# EAGLE schematic Fidgetspinner (EAGLE 9.2.1)
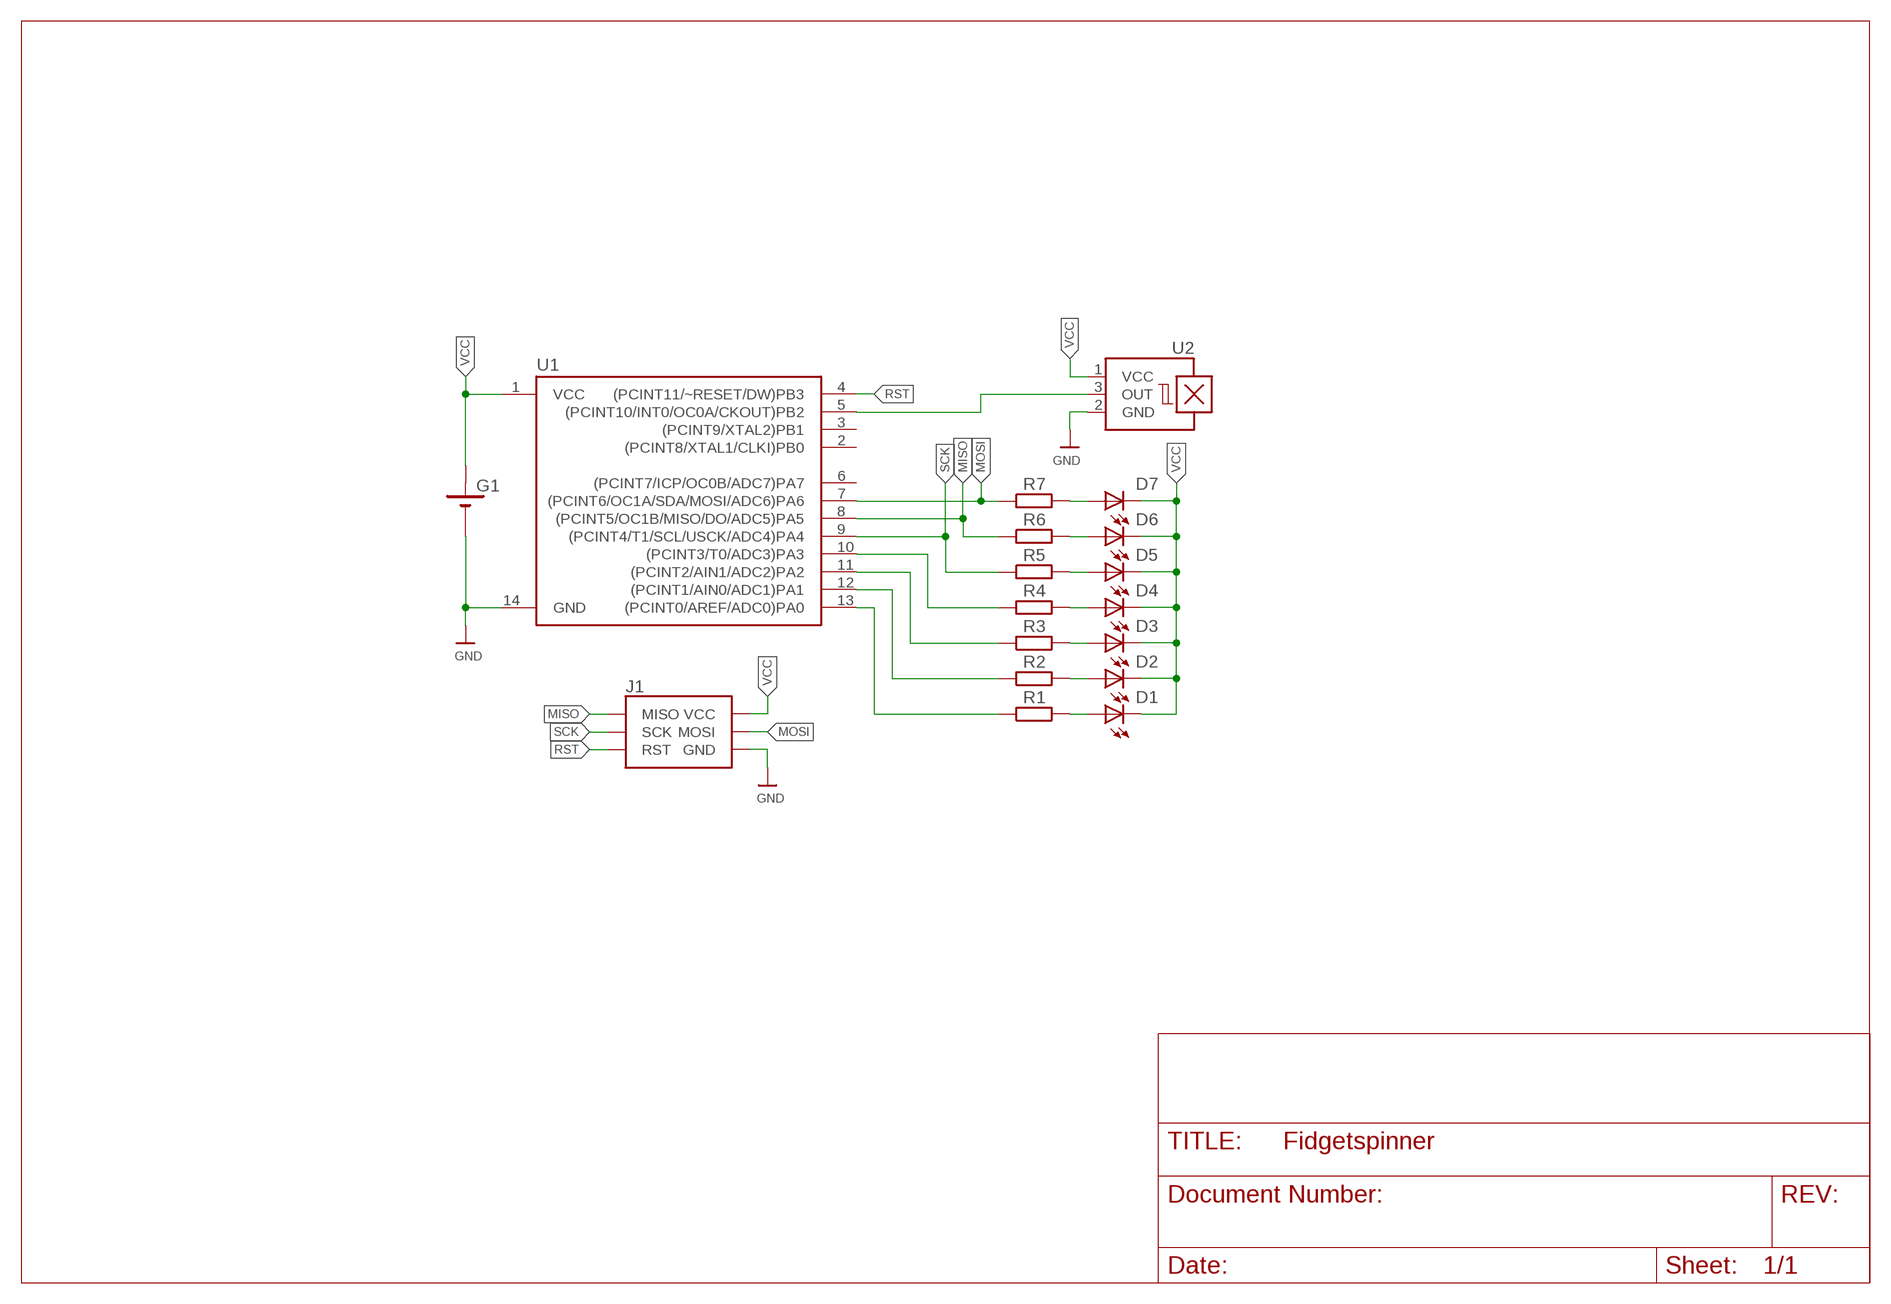
[diagram p0: schematic, sheet 1]

## Parts
D1  LEDCHIPLED_0805  [CHIPLED_0805]
D2  LEDCHIPLED_0805  [CHIPLED_0805]
D3  LEDCHIPLED_0805  [CHIPLED_0805]
D4  LEDCHIPLED_0805  [CHIPLED_0805]
D5  LEDCHIPLED_0805  [CHIPLED_0805]
D6  LEDCHIPLED_0805  [CHIPLED_0805]
D7  LEDCHIPLED_0805  [CHIPLED_0805]
G1  BATTERY  [10MM_SM_COIN_CELL_CLIP]
J1  SPI-HEADER2X3_LOCK  [2X3_LOCK]
R1  RESISTOR0805  [0805]
R2  RESISTOR0805  [0805]
R3  RESISTOR0805  [0805]
R4  RESISTOR0805  [0805]
R5  RESISTOR0805  [0805]
R6  RESISTOR0805  [0805]
R7  RESISTOR0805  [0805]
U1  ATTINY84ATTINY84-20PU  [DIP14]
U2  HALL-SWITCH02UA  [SIP3-UA]

## Nets
GND: G1.- J1.6(GND) U1.14(GND) U2.2(GND)
MISO: J1.1(MISO) R6.1 U1.8((PCINT5/OC1B/MISO/DO/ADC5)PA5)
MOSI: J1.4(MOSI) R7.1 U1.7((PCINT6/OC1A/SDA/MOSI/ADC6)PA6)
N$1: R1.1 U1.13((PCINT0/AREF/ADC0)PA0)
N$2: R2.1 U1.12((PCINT1/AIN0/ADC1)PA1)
N$3: R3.1 U1.11((PCINT2/AIN1/ADC2)PA2)
N$4: R4.1 U1.10((PCINT3/T0/ADC3)PA3)
N$5: U1.5((PCINT10/INT0/OC0A/CKOUT)PB2) U2.3(OUT)
N$8: D1.A R1.2
N$9: D2.A R2.2
N$10: D3.A R3.2
N$11: D4.A R4.2
N$12: D5.A R5.2
N$13: D6.A R6.2
N$14: D7.A R7.2
RST: J1.5(RST) U1.4((PCINT11/~RESET/DW)PB3)
SCK: J1.3(SCK) R5.1 U1.9((PCINT4/T1/SCL/USCK/ADC4)PA4)
VCC: D1.C D2.C D3.C D4.C D5.C D6.C D7.C G1.+@1(+) G1.+@2(+) J1.2(VCC) U1.1(VCC) U2.1(VCC)
Unconnected: U1.2((PCINT8/XTAL1/CLKI)PB0) U1.3((PCINT9/XTAL2)PB1) U1.6((PCINT7/ICP/OC0B/ADC7)PA7)

## Library data of the parts
D1-D7 = Fidgetspinner:LED: LED OSRAM: - CHIPLED LG R971, LG N971, LY N971, LG Q971, LY Q971, LO R971, LY R971 LH N974, LH R974 LS Q976, LO Q976, LY Q976 LO Q996 - Hyper CHIPLED LW Q18S LB Q993, LB Q99A, LB R99A - SideLED LS A670, LO A670, LY A670, LG A670, LP A670 LB A673, LV A673, LT A673, LW A673 LH A674 LY A675 LS A676, LA A676, LO A676, LY A676, LW A676 LS A679, LY A679, LG A679 - Hyper Micro SIDELED® LS Y876, LA Y876, LO Y876, LY Y876 LT Y87S - SmartLED LW L88C, LW L88S LB L89C, LB L89S, LG L890 LS L89K, LO L89K, LY L89K LS L896, LA L896, LO L896, LY L896 - TOPLED LS T670, LO T670, LY T670, LG T670, LP T670 LSG T670, LSP T670, LSY T670, LOP T670, LYG T670 LG T671, LOG T671, LSG T671 LB T673, LV T673, LT T673, LW T673 LH T674 LS T676, LA T676, LO T676, LY T676, LB T676, LH T676, LSB T676, LW T676 LB T67C, LV T67C, LT T67C, LS T67K, LO T67K, LY T67K, LW E67C LS E67B, LA E67B, LO E67B, LY E67B, LB E67C, LV E67C, LT E67C LW T67C LS T679, LY T679, LG T679 LS T770, LO T770, LY T770, LG T770, LP T770 LB T773, LV T773, LT T773, LW T773 LH T774 LS E675, LA E675, LY E675, LS T675 LS T776, LA T776, LO T776, LY T776, LB T776 LHGB T686 LT T68C, LB T68C - Hyper Mini TOPLED® LB M676 - Mini TOPLED Santana® LG M470 LS M47K, LO M47K, LY M47K Source: http://www.osram.convergy.de/
G1 = Fidgetspinner:BATTERY: Battery cell clip for CR927 Source: KEYSTONE ELECTRONICS CORP. www.keyelco.com, ASTORIA, N.Y. 11105-2017 PART ANME 10mm SM COIN CELl CLIP DWG NO. 3030
J1 = Fidgetspinner:SPI-HEADER: AVR ISP 6 Pin This is the reduced ISP connector for AVR programming. Common on Arduino. This footprint will take up less PCB space and can be used with a 10-pin to 6-pin adapter such as SKU: BOB-08508 **Special note about "TEST_POINT" package. The stop mask is on the top side, so if you want your programming test points to be on the bottom of your board, make sure to place this package on the bottom side of the board. This also ensure that the orientation to program from the bottom side will be correct. SparkFun Products: SparkFun ISP Pogo Adapter <https://www.sparkfun.com/products/11591> - NS Tiny AVR Programmer <https://www.sparkfun.com/products/11801> -PTH
R1-R7 = Fidgetspinner:RESISTOR
U1 = Fidgetspinner:ATTINY84: Atmel 14-pin 2/4/8kB flash uC Datasheet <https://cdn.sparkfun.com/datasheets/Widgets/doc8006.pdf> SparkFun Products Tiny AVR Programmer <https://www.sparkfun.com/products/11801> (PGM-11801) SparkFun Servo Trigger - Continuous Rotation <https://www.sparkfun.com/products/13872> (WIG-13872) SparkFun Servo Trigger <https://www.sparkfun.com/products/13118> (WIG-13118)
U2 = Fidgetspinner:HALL-SWITCH: Hall-effect bipolar switch Source: http://www.allegromicro.com/en/Products/Part_Numbers/1202/1202.pdf; OC_FARNELL: unknown; OC_NEWARK: unknown